# Altium schematic sheet OutputVoltageSensingSketch.SchDoc
size A4; SheetNumber: 6; SheetTotal: 8
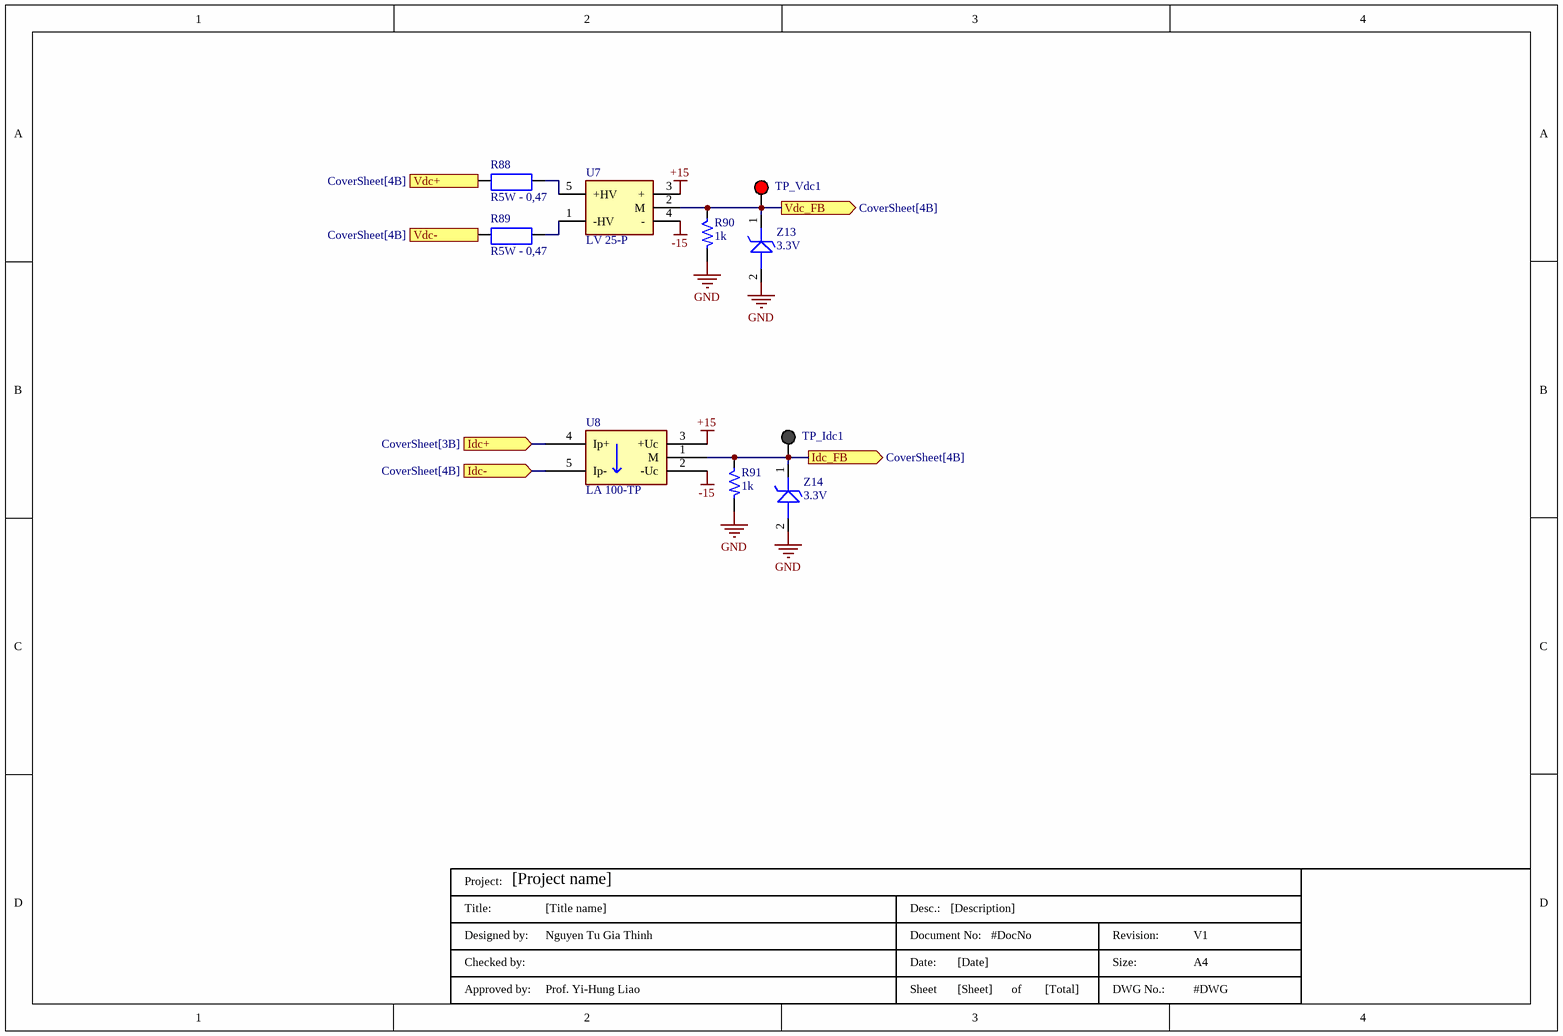
[diagram p0: OutputVoltageSensingSketch.SchDoc]

## Parts
R88  R5W - 0,47  [R5WD]
R89  R5W - 0,47  [R5WD]
R90  1k  [SM-1206]
R91  1k  [SM-1206]
TitleBlock  DWG No.: #DWG  Size:: A4  Revision:: V1  Total of Sheets: [Total]  Sheet: [Sheet]  Date:: [Date]  Document No:: #DocNo  Desc.:: [Description]  Approved by:: Prof. Yi-Hung Liao  Designed by:: Nguyen Tu Gia Thinh  Title:: [Title name]  Project: [Project name]  (hidden comment: TitleBlock)  (graphical)
TP_Idc1  (no value)  [5001]
TP_Vdc1  (no value)  [5000]
U7  LV 25-P  [LV-25-P]
U8  LA 100-TP  [LA 100-TP]
Z13  3.3V  [DIOM5226X230N]
Z14  3.3V  [DIOM5226X230N]

## Ports
Idc+ (in, see CoverSheet[3B]), Idc- (in, see CoverSheet[4B]), Idc_FB (out, see CoverSheet[4B]), Vdc+ (in, see CoverSheet[4B]), Vdc- (in, see CoverSheet[4B]), Vdc_FB (out, see CoverSheet[4B])

## Nets
+15: U7.3(+) U8.3(+Uc)
-15: U7.4(-) U8.2(-Uc)
GND: R90.2 R91.2 Z13.2(A) Z14.2(A)
Idc+: U8.4(Ip+) ; port Idc+
Idc-: U8.5(Ip-) ; port Idc-
Idc_FB: R91.1 TP_Idc1.1 U8.1(M) Z14.1(K) ; port Idc_FB
Vdc+: R88.1 ; port Vdc+
Vdc-: R89.1 ; port Vdc-
Vdc_FB: R90.1 TP_Vdc1.1 U7.2(M) Z13.1(K) ; port Vdc_FB
NetR88_2: R88.2 U7.5(+HV)
NetR89_2: R89.2 U7.1(-HV)

## Notes on the sheet
- (in symbol Title Block 2) Project:; Title:; Desc.:; Designed by:; Document No:; Revision:; Checked by:; Date:; Size:; Approved by:; Sheet; of; DWG No.:

## Library data of the parts
R88 R89 = R5W: Resistor 5W; Value: R5W - 0,47R
R90 R91 = R: Resistor 1/4W; Value: R1/4W - 1K
TitleBlock = Title Block 2
TP_Idc1 = 5001: Test Point Black, Multipurpose, TH
TP_Vdc1 = 5000: Test Point Red, Multipurpose, TH
U7 = LV 25-P: Voltage Transducer 600V; Manufacturer_Name: LEM; Manufacturer_Part_Number: LV25P
U8 = LA 100-TP: Current Transducer, AC/AC, 100A
Z13 Z14 = BZG05C3V3-HM3-08: Zener Diode; Manufacturer_Name: Vishay; Datasheet Link: https://www.vishay.com/doc?86135; Height: 2.3mm; Manufacturer_Part_Number: BZG05C3V3-HM3-08; Mouser Part Number: 78-BZG05C3V3-HM3-08; Mouser Price/Stock: https://www.mouser.co.uk/ProductDetail/Vishay-Semiconductors/BZG05C3V3-HM3-08?qs=W0yvOO0ixfFdOsuRX87wbg%3D%3D; Arrow Part Number: BZG05C3V3-HM3-08; Arrow Price/Stock: https://www.arrow.com/en/products/bzg05c3v3-hm3-08/vishay?region=nac